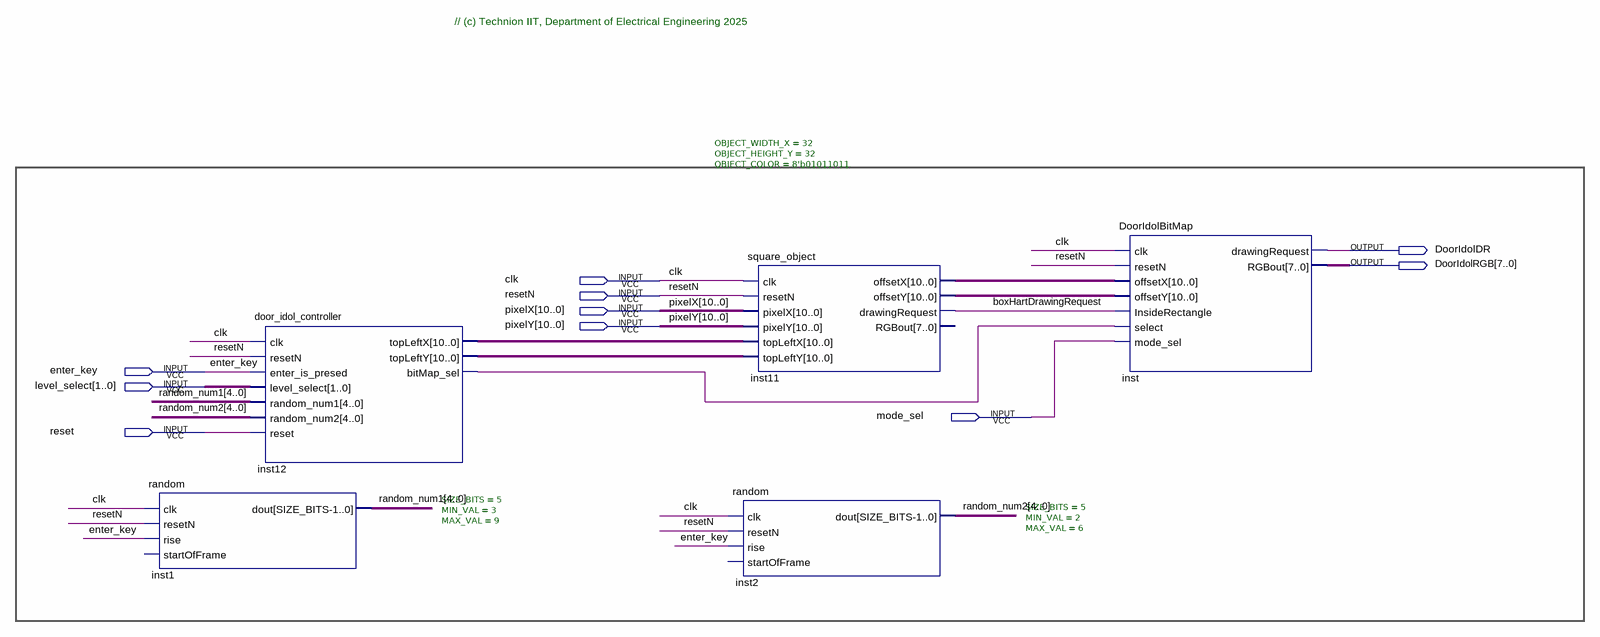
[diagram p0: schematic sheet]
// Quartus schematic Door_and_Idol.bdf as structural Verilog: 5 symbols, 10 pins
module Door_and_Idol (
  input  clk,
  input  resetN,
  input  [10:0] pixelX,
  input  [10:0] pixelY,
  input  enter_key,
  input  [1:0] level_select,
  input  mode_sel,
  input  reset,
  output DoorIdolDR,
  output [7:0] DoorIdolRGB
);

  wire boxHartDrawingRequest, inst12_bitmap_sel;
  wire [4:0] random_num1, random_num2;
  wire [10:0] inst11_offsetx, inst11_offsety, inst12_topleftx, inst12_toplefty;

  random #(.SIZE_BITS(5), .MIN_VAL(3), .MAX_VAL(9)) inst1 (
    .clk(clk), .resetN(resetN), .rise(enter_key), .dout(random_num1));  // open: startOfFrame
  door_idol_controller inst12 (
    .clk(clk), .resetN(resetN), .enter_is_presed(enter_key), .level_select(level_select),
    .random_num1(random_num1), .random_num2(random_num2), .reset(reset), .topLeftX(inst12_topleftx),
    .topLeftY(inst12_toplefty), .bitMap_sel(inst12_bitmap_sel));
  square_object #(.OBJECT_WIDTH_X(32), .OBJECT_HEIGHT_Y(32), .OBJECT_COLOR(8'b01011011)) inst11 (
    .clk(clk), .resetN(resetN), .pixelX(pixelX), .pixelY(pixelY), .topLeftX(inst12_topleftx),
    .topLeftY(inst12_toplefty), .offsetX(inst11_offsetx), .offsetY(inst11_offsety),
    .drawingRequest(boxHartDrawingRequest));  // open: RGBout
  random #(.SIZE_BITS(5), .MIN_VAL(2), .MAX_VAL(6)) inst2 (
    .clk(clk), .resetN(resetN), .rise(enter_key), .dout(random_num2));  // open: startOfFrame
  DoorIdolBitMap inst (
    .clk(clk), .resetN(resetN), .offsetX(inst11_offsetx), .offsetY(inst11_offsety),
    .InsideRectangle(boxHartDrawingRequest), .select(inst12_bitmap_sel), .mode_sel(mode_sel),
    .drawingRequest(DoorIdolDR), .RGBout(DoorIdolRGB));

  // Notes on the sheet:
  //   // (c) Technion IIT, Department of Electrical Engineering 2025
endmodule
